# Altium schematic sheet regulador.SchDoc
size A4
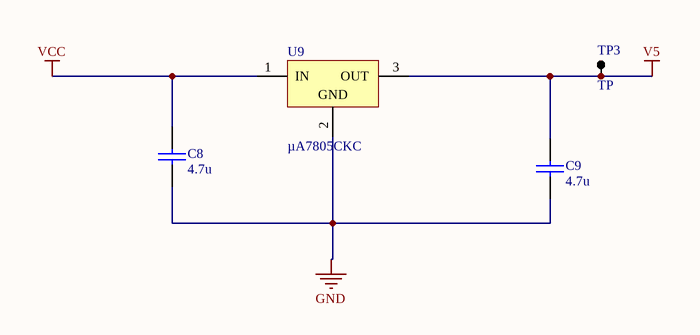
[diagram p0: regulador.SchDoc]

## Parts
C8  4.7u  [0805]
C9  4.7u  [0805]
TP3  TP  [TPTH]
U9  µA7805CKC  [KC03]

## Nets
GND: C8.2 C9.2 U9.2(GND)
V5: C9.1 TP3.1 U9.3(OUT)
VCC: C8.1 U9.1(IN)

## Library data of the parts
C8 C9 = CAP
U9 = µA7805CKC: Positive-Voltage Regulator; Note: Pin 2 is electrically connected to TAB.; Published: 15-Apr-2002; DatasheetVersion: Jul-1999; PackageVersion: Sep-1995; PackageReference: KC03; Publisher: Altium Limited; PackageDescription: TO, Thru-Hole, Vertical, Heatsink Mounted; 3 In-Line Leads; Pitch 2.54 mm; ComponentLink1Description: Manufacturer Link; ComponentLink1URL: http://www.ti.com/; ComponentLink2Description: Datasheet; ComponentLink2URL: http://www-s.ti.com/sc/ds/ua7805.pdf